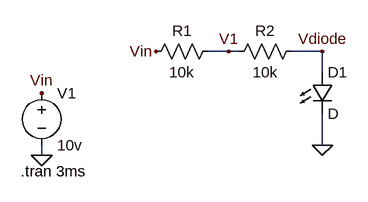
[diagram p0: schematic voltageDivider.asc]
voltageDivider.asc, the LTspice schematic file:
Version 4.1
SHEET 1 880 680
WIRE 304 144 272 144
WIRE 320 144 304 144
WIRE 448 144 400 144
WIRE 448 176 448 144
WIRE 448 288 448 240
WIRE 16 304 16 288
FLAG 16 304 0
FLAG 448 288 0
FLAG 304 144 V1
FLAG 448 144 Vdiode
FLAG 16 208 Vin
FLAG 192 144 Vin
SYMBOL res 288 128 R90
WINDOW 0 0 56 VBottom 2
WINDOW 3 32 56 VTop 2
SYMATTR InstName R1
SYMATTR Value 10k
SYMBOL LED 432 176 R0
SYMATTR InstName D1
SYMBOL voltage 16 192 R0
WINDOW 123 0 0 Left 0
WINDOW 39 0 0 Left 0
SYMATTR InstName V1
SYMATTR Value 10v
SYMBOL res 416 128 R90
WINDOW 0 0 56 VBottom 2
WINDOW 3 32 56 VTop 2
SYMATTR InstName R2
SYMATTR Value 10k
TEXT -16 328 Left 2 !.tran 3ms

The netlist it stands for:
* voltageDivider.asc
R1 V1 Vin 10k
D1 Vdiode 0 D
V1 Vin 0 10v
R2 Vdiode V1 10k
.model D D
.lib standard.dio
.tran 3ms
.backanno
.end

* Results of the author's LTspice run, read from the files saved beside the schematic
* Operating Point, zero values left out:
*   V(v1) = 5.318 V
*   V(vdiode) = 635.5 mV
*   V(vin) = 10 V
*   I(D1) = 468.2 µA
*   I(R1) = -468.2 µA
*   I(R2) = -468.2 µA
*   I(V1) = -468.2 µA